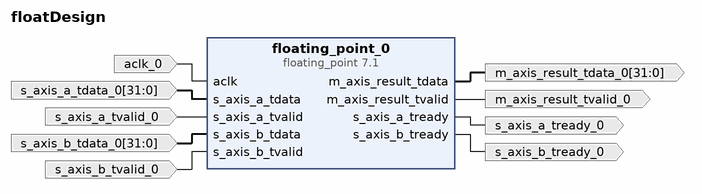
[diagram p0: block diagram of the top level]
# Vivado block design floatDesign, xc7z010clg400-1, Vivado 2024.2
create_bd_design floatDesign

create_bd_port -dir I -from 31 -to 0 s_axis_a_tdata_0
create_bd_port -dir I -from 31 -to 0 s_axis_b_tdata_0
create_bd_port -dir I s_axis_b_tvalid_0
create_bd_port -dir I s_axis_a_tvalid_0
create_bd_port -dir I -type clk aclk_0
set_property -dict {CONFIG.FREQ_HZ 10000000} [get_bd_ports aclk_0]
create_bd_port -dir O -from 31 -to 0 m_axis_result_tdata_0
create_bd_port -dir O m_axis_result_tvalid_0
create_bd_port -dir O s_axis_b_tready_0
create_bd_port -dir O s_axis_a_tready_0

create_bd_cell -type ip -vlnv xilinx.com:ip:floating_point:7.1 floating_point_0
set_property -dict [list \
  CONFIG.C_Latency 9 \
  CONFIG.C_Mult_Usage Full_Usage \
  CONFIG.C_Rate 1 \
  CONFIG.C_Result_Exponent_Width 8 \
  CONFIG.C_Result_Fraction_Width 24 \
  CONFIG.Operation_Type Multiply \
  CONFIG.Result_Precision_Type Single \
] [get_bd_cells floating_point_0]

# ---- connections ----

connect_bd_net -net aclk_0_1 [get_bd_ports aclk_0] [get_bd_pins floating_point_0/aclk]
connect_bd_net [get_bd_pins floating_point_0/m_axis_result_tdata] [get_bd_ports m_axis_result_tdata_0]
connect_bd_net [get_bd_pins floating_point_0/m_axis_result_tvalid] [get_bd_ports m_axis_result_tvalid_0]
connect_bd_net [get_bd_pins floating_point_0/s_axis_a_tready] [get_bd_ports s_axis_a_tready_0]
connect_bd_net [get_bd_pins floating_point_0/s_axis_b_tready] [get_bd_ports s_axis_b_tready_0]
connect_bd_net -net s_axis_a_tdata_0_1 [get_bd_ports s_axis_a_tdata_0] [get_bd_pins floating_point_0/s_axis_a_tdata]
connect_bd_net -net s_axis_a_tvalid_0_1 [get_bd_ports s_axis_a_tvalid_0] [get_bd_pins floating_point_0/s_axis_a_tvalid]
connect_bd_net -net s_axis_b_tdata_0_1 [get_bd_ports s_axis_b_tdata_0] [get_bd_pins floating_point_0/s_axis_b_tdata]
connect_bd_net -net s_axis_b_tvalid_0_1 [get_bd_ports s_axis_b_tvalid_0] [get_bd_pins floating_point_0/s_axis_b_tvalid]

validate_bd_design
save_bd_design
